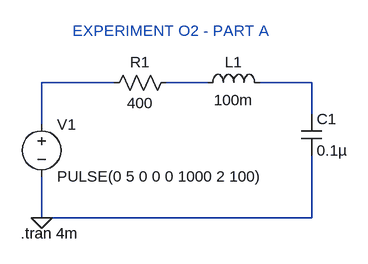
[diagram p0: schematic LTSPICE_CIRCUITO1.asc]
LTSPICE_CIRCUITO1.asc, the LTspice schematic file:
Version 4
SHEET 1 880 680
WIRE 80 80 -32 80
WIRE 224 80 160 80
WIRE 384 80 304 80
WIRE 384 128 384 80
WIRE -32 144 -32 80
WIRE -32 288 -32 224
WIRE 384 288 384 192
WIRE 384 288 -32 288
FLAG -32 288 0
SYMBOL res 176 64 R90
WINDOW 0 0 56 VBottom 2
WINDOW 3 32 56 VTop 2
SYMATTR InstName R1
SYMATTR Value 400
SYMBOL ind 208 96 R270
WINDOW 0 32 56 VTop 2
WINDOW 3 5 56 VBottom 2
SYMATTR InstName L1
SYMATTR Value 100m
SYMBOL cap 368 128 R0
SYMATTR InstName C1
SYMATTR Value 0.1µ
SYMBOL voltage -32 128 R0
WINDOW 123 0 0 Left 0
WINDOW 39 0 0 Left 0
SYMATTR InstName V1
SYMATTR Value PULSE(0 5 0 0 0 1000 2 100)
TEXT -64 312 Left 2 !.tran 4m
TEXT 16 0 Left 2 ;EXPERIMENT O2 - PART A

The netlist it stands for:
* LTSPICE_CIRCUITO1.asc
R1 N002 N001 400
L1 N002 N003 100m
C1 N003 0 0.1µ
V1 N001 0 PULSE(0 5 0 0 0 1000 2 100)
.tran 4m
* EXPERIMENT O2 - PART A
.backanno
.end